# Altium schematic sheet BlueFlower POT.SchDoc: Arkusz główny
size A4; Date: 23-02-2017; Author: Mateusz Gancarczyk; Revision: ver 2.0; SheetNumber: 1; SheetTotal: 2; PageSetup: Record=PageOptions|CenterHorizontal=True|CenterVertical=True|PrintScale=1.00|XCorrection=1.00|YCorrection=1.00|PrintKind=0|BorderSize=5000000|LeftOffset=0|BottomOffset=0|Orientation=2|PaperLength=1000|PaperWidth=1000|Scale=100|PaperSource=7|PrintQuality=-4|MediaType=1|DitherType=10|PaperKind=A3 (297 x 420 mm)|PrintScaleMode=0; NameOfProject: Smart Flower Pot; NameOfSheet: Main sheet; ProjectName: Projekt XXX
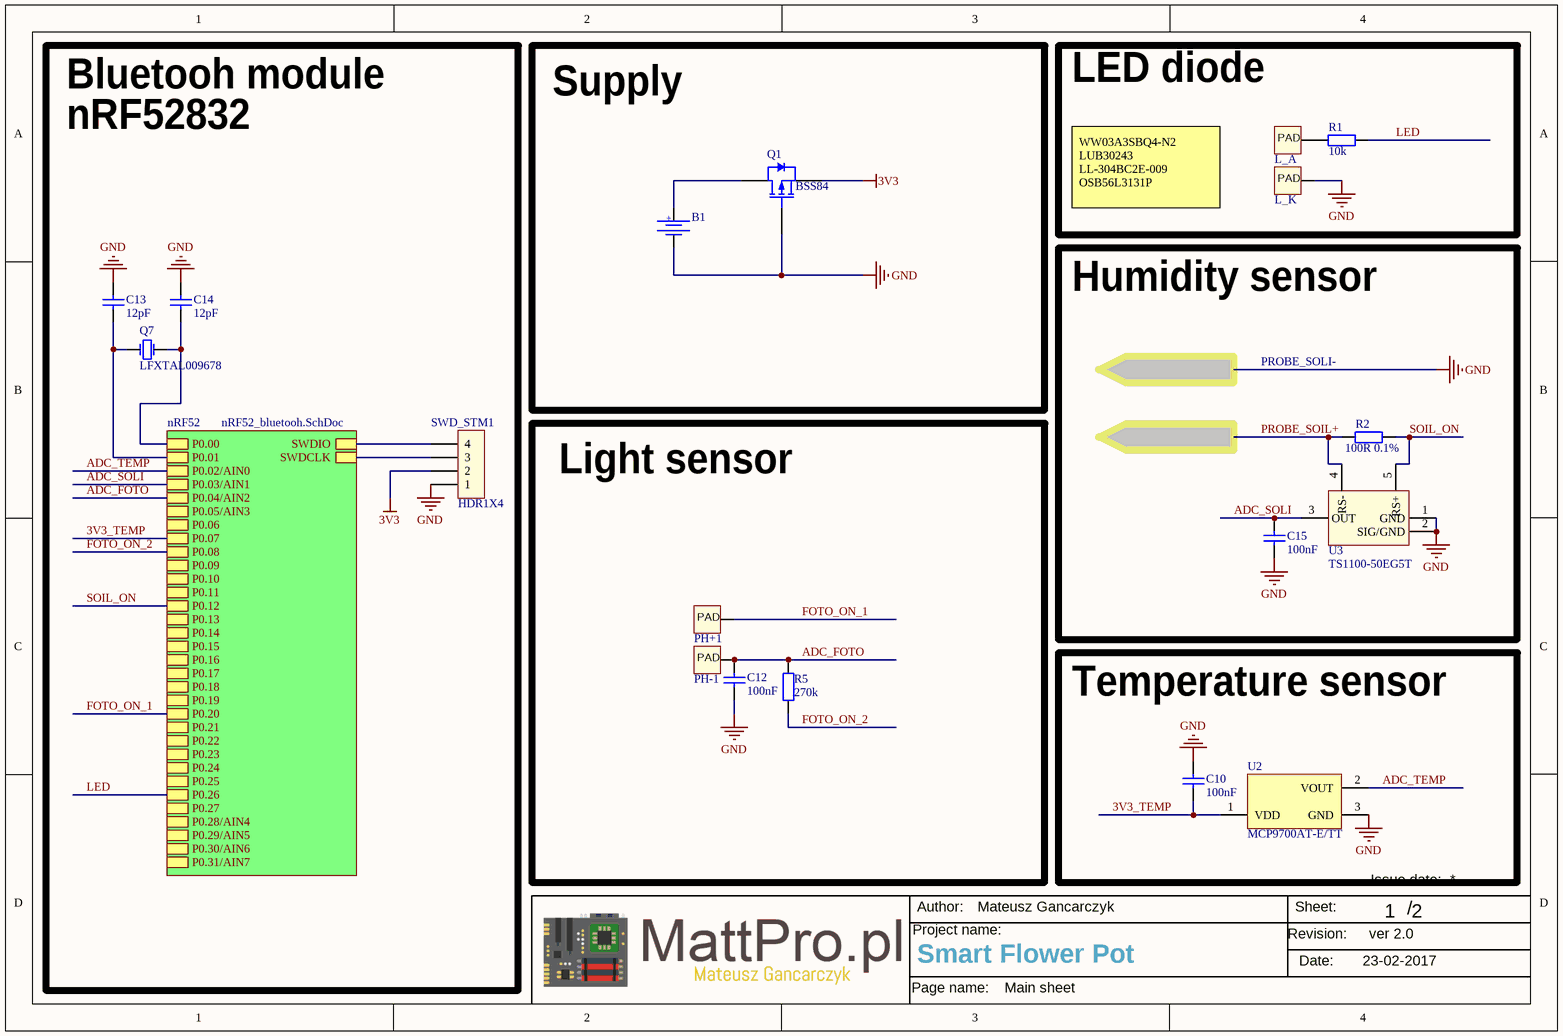
[diagram p0: BlueFlower POT.SchDoc]

## Parts
B1  BC-2001  [CR2032_HOLDER_SMD]  (value not drawn)
C10  Wartość: 100nF  [SMD 0603S - CAPACITOR]  (hidden comment: 0603 100nF 20V)
C12  Wartość: 100nF  [SMD 0603S - CAPACITOR]  (hidden comment: 0603 100nF 20V)
C13  Wartość: 12pF  [SMD 0603S - CAPACITOR]  (hidden comment: 0603 12pF 20V)
C14  Wartość: 12pF  [SMD 0603S - CAPACITOR]  (hidden comment: 0603 12pF 20V)
C15  Wartość: 100nF  [SMD 0603S - CAPACITOR]  (hidden comment: 0603 100nF 20V)
L_A  Pad lutowniczy  [PAD_3x0.8mm]  (value not drawn)  (no BOM)
L_K  Pad lutowniczy  [PAD_3x0.8mm]  (value not drawn)  (no BOM)
PH+1  Pad lutowniczy  [PAD_3x0.8mm]  (value not drawn)  (no BOM)
PH-1  Pad lutowniczy  [PAD_3x0.8mm]  (value not drawn)  (no BOM)
Q1  BSS84  [SOT-23A]
Q7  LFXTAL009678  [Kwarc SMD 3.2 na 1.5mm]
R1  Wartosc: 10k  [SMD 0603]  (hidden comment: 0603 10k 1% 0.25W)
R2  Wartosc: 100R 0.1%  [SMD 0805]  (hidden comment: 0805 100R 0.1% 0.25W)
R5  Wartosc: 270k  [SMD 0603]  (hidden comment: 0603 270k 1% 0.25W)
SWD_STM1  HDR1X4  [HDR1x4_1.27mm]
U2  MCP9700AT-E/TT  [SOT-23-TT3_N]
U3  TS1100-50EG5T  [SOT-23]

## Blocks framed on the sheet
Supply: B1 Q1
LED diode: L_A L_K R1
Humidity sensor: C15 R2 U3
Light sensor: C12 PH+1 PH-1 R5
Temperature sensor: C10 U2

## Sub-sheets
nRF52 = nRF52_bluetooh.SchDoc: P0.00, P0.01, P0.02/AIN0, P0.03/AIN1, P0.04/AIN2, P0.05/AIN3, P0.06, P0.07, P0.08, P0.09, P0.10, P0.11, P0.12, P0.13, P0.14, P0.15, P0.16, P0.17, P0.18, P0.19, P0.20, P0.21, P0.22, P0.23, P0.24, P0.25, P0.26, P0.27, P0.28/AIN4, P0.29/AIN5, P0.30/AIN6, P0.31/AIN7, SWDIO, SWDCLK

## Nets
3V3: Q1.2(S) SWD_STM1.2
GND: B1.2 C10.2 C12.1 C13.2 C14.2 C15.1 L_K.1 Q1.1(G) SWD_STM1.1 U2.3(GND) U3.1(GND) U3.2(SIG/GND)
3V3_TEMP: C10.1 U2.1(VDD) ; sheet nRF52/P0.07
ADC_FOTO: C12.2 PH-1.1 R5.1 ; sheet nRF52/P0.04/AIN2
ADC_SOLI: C15.2 U3.3(OUT) ; sheet nRF52/P0.03/AIN1
ADC_TEMP: U2.2(VOUT) ; sheet nRF52/P0.02/AIN0
FOTO_ON_1: PH+1.1 ; sheet nRF52/P0.20
FOTO_ON_2: R5.2 ; sheet nRF52/P0.08
LED: R1.2 ; sheet nRF52/P0.26
PROBE_SOIL+: R2.1 U3.4(RS-)
SOIL_ON: R2.2 U3.5(RS+) ; sheet nRF52/P0.12
NetB1_1: B1.1 Q1.3(D)
NetC13_1: C13.1 Q7.1 ; sheet nRF52/P0.01
NetC14_1: C14.1 Q7.2 ; sheet nRF52/P0.00
NetL_A_1: L_A.1 R1.1
NetSWD_STM1_3: SWD_STM1.3 ; sheet nRF52/SWDCLK
NetSWD_STM1_4: SWD_STM1.4 ; sheet nRF52/SWDIO

## Notes on the sheet
- Bluetooh module
- nRF52832
- WW03A3SBQ4-N2
  LUB30243
  LL-304BC2E-009
  OSB56L3131P
- PROBE_SOLI-
- TEPT4400
  Uzupełniamy nasz algorytm pomiaru:
  włączamy czujnik ustawiając pin PC0 jako wyjście i podajemy na niego jedynkę logiczną,
  włączamy masę rezystora ustawiając PC2 jako wyjście i podajemy na niego zero logiczne,
  czekamy chwilkę na ustabilizowanie się napięcia na kondensatorze,
  dokonujemy pomiaru pinu ADC1,
  po zakończonym pomiarze wyłączamy czujnik poprzez ustawienie pinów zasilania i masy rezystora w stan wysokiej impedancji, czyli jako wejście z wyłączonym rezystorem pull-up.
  http://mikrokontrolery.blogspot.com/2011/04/SmartPIP-czujnik-swiatla-oszczedzanie-energii.html
- Author:
- Sheet:
- /
- Issue date:
- Project name:
- Date:
- Revision:
- Page name:
- (in symbol Battery) +
- (in symbol Pad) PAD

## Library data of the parts
B1 = Battery: Bat Holder CR2032 SMD; Manufacturer: Comfortable; 2nd source part number: 165-0693; Artikkelnr Noca: 55089011; Artikkelnr Simpro: N.A.; Part Number: Bat Holder CR2032 SMD; Manufacturer Part Number: BC-2001; Datasheet: \\hizz\pro\app9717\Datasheet\connectores\Comfortable\BC-2001.pdf; Footprint Doc: CR2032_HOLDER_SMD; LatestRevisionDate: 2016-04-21; Pin Count: 3; Publisher: Nordic Semiconductor; Published: 2009-12-12; Value: Bat Holder CR2032; Note: Bat Holder CR2032; Supplier: Cabcon; Supplier part number: BC-2001/T & R; 2nd source Supplier: Farnell
C10 C12-C15 = Kondensator SMD: Kondensator
L_A L_K PH+1 PH-1 = Pad
Q1 = BSS84: Tranzystor MOSFET kanał P; Typ obudowy: SOT23; Published: 17-Sep-2003; LatestRevisionDate: 12-Dec-2006; LatestRevisionNote: IPC-7351 Footprint Added.; DatasheetVersion: 18-Jun-1997; PackageVersion: May-1999; PackageReference: SOT23; Publisher: Altium Limited; PackageDescription: 3-Pin SOT-23 Package 0.95 mm Pitch, 2.3 mm Lead Span; ComponentLink1Description: Manufacturer Link; ComponentLink1URL: http://www.semiconductors.philips.com/; ComponentLink2Description: Datasheet; ComponentLink2URL: http://www.semiconductors.philips.com/acrobat/datasheets/BSS84_3.pdf; Opis: Tranzystor MOSFET kanał P; Wartość: BSS84
Q7 = LFXTAL009678: Kwarc 32kHz SMD
R1 R2 R5 = Rezystor SMD: Rezystor
SWD_STM1 = HDR1X4: Pin header 1x4
U2 = MCP9700AT-E/TT: Czujnik Temperatury; Manufacturer: Microchip; DatasheetVersion: revE, Apr-2009; PackageVersion: revBB, Aug-2009; PackageReference: SOT-23-TT3; PackageDescription: 3-Lead Plastic Small Outline Transistor (TT) [SOT-23]; Supplier 1: Digi-Key; Supplier Part Number 1: MCP9700AT-E/TTTR-ND; Supplier 2: Digi-Key; Supplier Part Number 2: MCP9700AT-E/TTCT-ND; Supplier 3: Digi-Key; Supplier Part Number 3: MCP9700AT-E/TTDKR-ND; Supplier 4: Farnell; Supplier Part Number 4: 1605577RL; Supplier 5: Farnell; Supplier Part Number 5: 1605577; Supplier 6: Newark; Supplier Part Number 6: 84R5199; Supplier 7: Newark; Supplier Part Number 7: 17M0677; Supplier 8: Mouser; Supplier Part Number 8: 579-MCP9700AT-E/TT; Mounting Technology: Surface Mount; Code_IPC: SOT23-3; PartNumber: MCP9700AT-E/TT; ComponentLink1Description: Manufacturer URL; ComponentLink1URL: http://www.microchip.com/; ComponentLink2Description: Datasheet; ComponentLink2URL: http://ww1.microchip.com/downloads/en/DeviceDoc/21942e.pdf; ComponentLink3Description: Package Specification; ComponentLink3URL: http://www.microchip.com/stellent/groups/techpub_sg/documents/packagingspec/en012702.pdf
U3 = TS1100: Low-power current sense; Wartość: TS1100-50EG5T